# EAGLE design ArduFrauenfelderCNC_1.0_[ArduinoProMicro] (EAGLE 6.2)
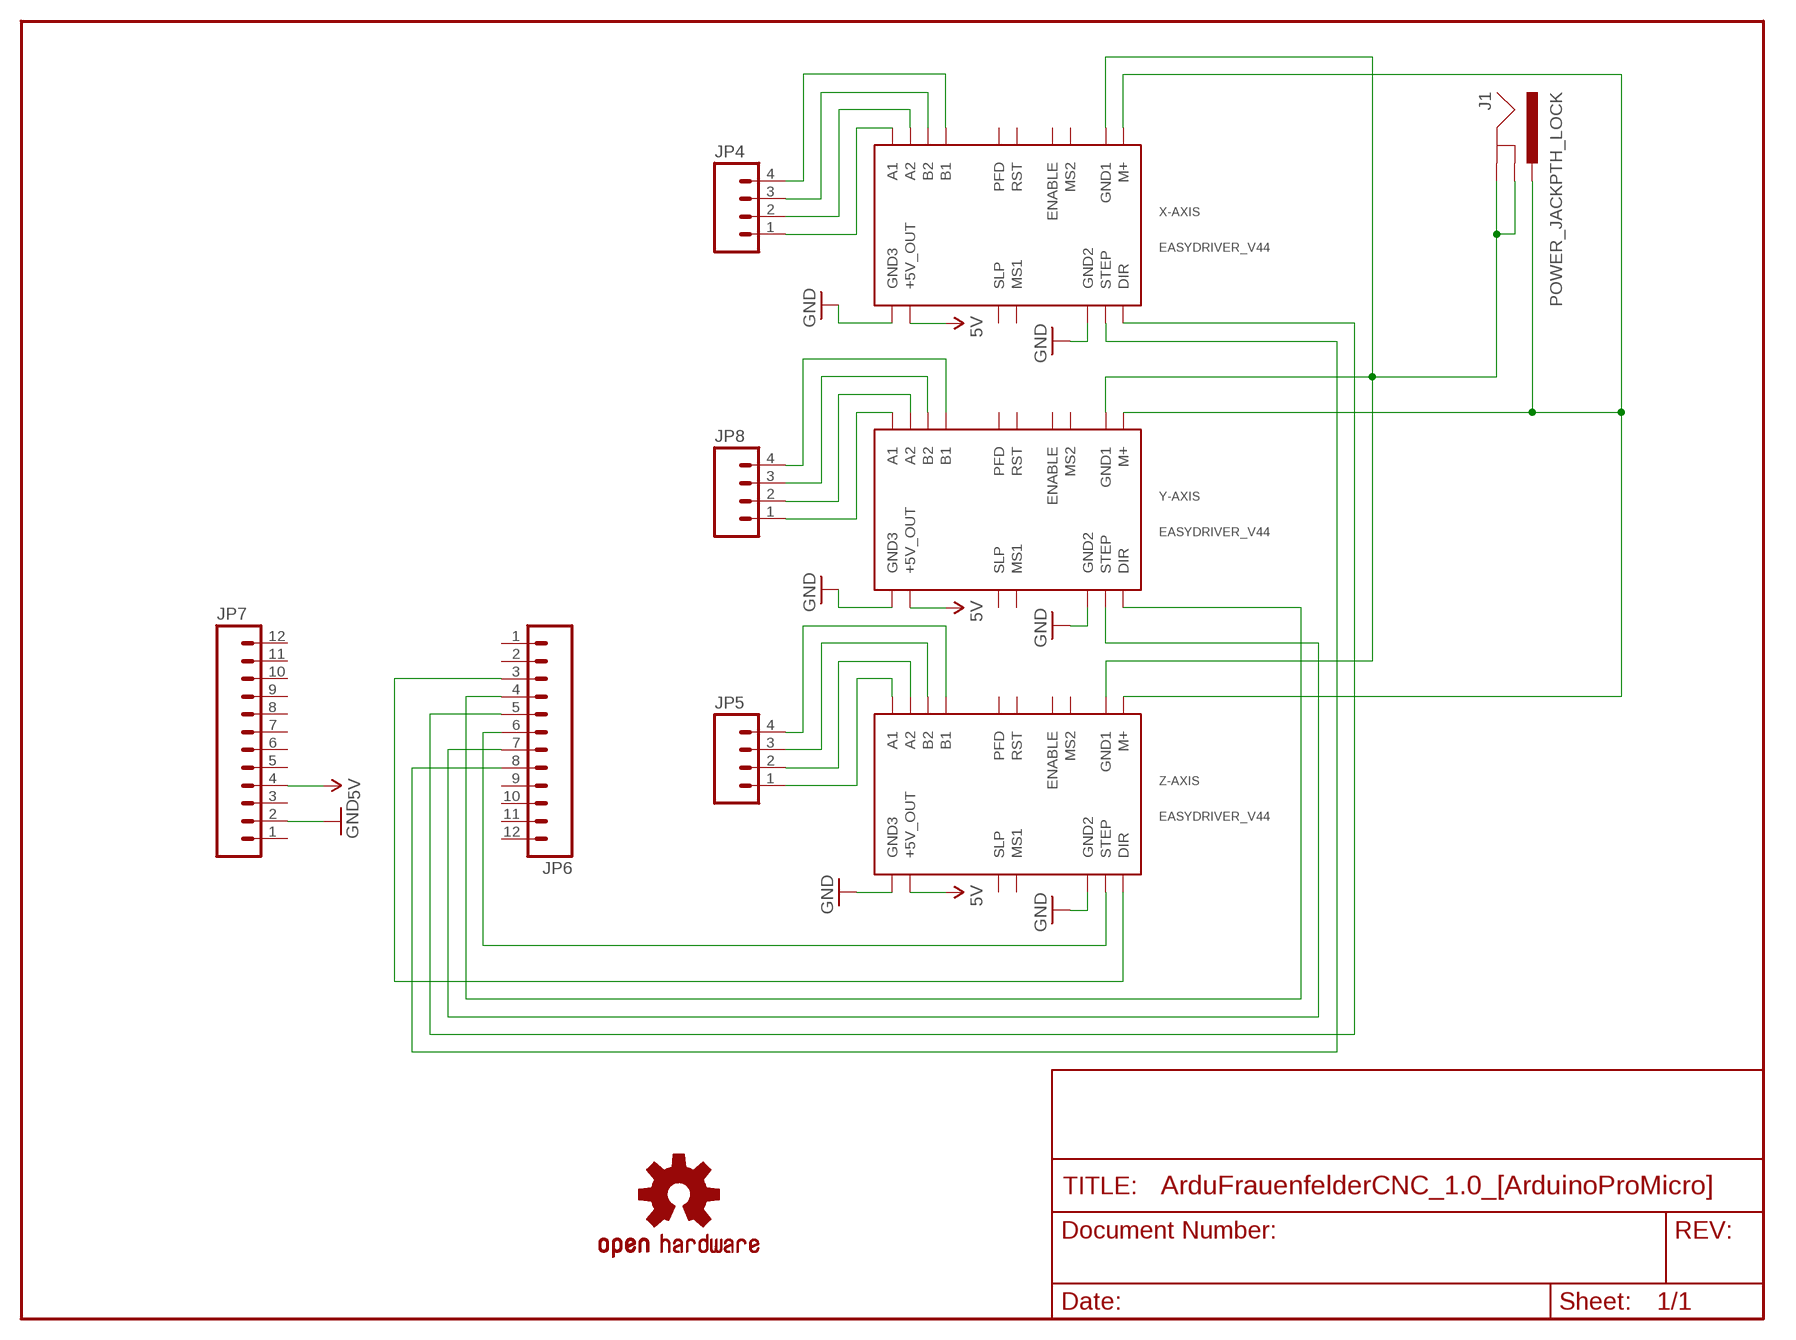
[diagram p0: schematic, sheet 1]

## Parts
J1  POWER_JACKPTH_LOCK  [POWER_JACK_PTH_LOCK]
JP4  M04LOCK_LONGPADS  [1X04_LOCK_LONGPADS]
JP5  M04LOCK_LONGPADS  [1X04_LOCK_LONGPADS]
JP6  M12PTH  [1X12]
JP7  M12PTH  [1X12]
JP8  M04LOCK_LONGPADS  [1X04_LOCK_LONGPADS]
U$2  OSHW-LOGOM  [OSHW-LOGO-M]
X-AXIS  EASYDRIVER_V44  [EASYDRIVER_V44]
Y-AXIS  EASYDRIVER_V44  [EASYDRIVER_V44]
Z-AXIS  EASYDRIVER_V44  [EASYDRIVER_V44]

## Nets
5V: JP7.4 X-AXIS.P$11(+5V_OUT) Y-AXIS.P$11(+5V_OUT) Z-AXIS.P$11(+5V_OUT)
GND: JP7.2 X-AXIS.GND2 X-AXIS.GND3 Y-AXIS.GND2 Y-AXIS.GND3 Z-AXIS.GND2 Z-AXIS.GND3
N$1: J1.GND J1.GNDBREAK X-AXIS.GND1 Y-AXIS.GND1 Z-AXIS.GND1
N$2: JP4.1 X-AXIS.A1
N$3: JP4.2 X-AXIS.A2
N$4: J1.PWR X-AXIS.M+ Y-AXIS.M+ Z-AXIS.M+
N$5: JP4.3 X-AXIS.B2
N$6: JP4.4 X-AXIS.B1
N$7: JP8.1 Y-AXIS.A1
N$8: JP8.2 Y-AXIS.A2
N$9: JP8.3 Y-AXIS.B2
N$10: JP8.4 Y-AXIS.B1
N$11: JP5.1 Z-AXIS.A1
N$12: JP5.2 Z-AXIS.A2
N$13: JP5.3 Z-AXIS.B2
N$14: JP5.4 Z-AXIS.B1
N$15: JP6.8 X-AXIS.STEP
N$16: JP6.5 X-AXIS.DIR
N$17: JP6.7 Y-AXIS.STEP
N$18: JP6.4 Y-AXIS.DIR
N$19: JP6.6 Z-AXIS.STEP
N$20: JP6.3 Z-AXIS.DIR
Unconnected: JP6.1 JP6.2 JP6.9 JP6.10 JP6.11 JP6.12 JP7.1 JP7.3 JP7.5 JP7.6 JP7.7 JP7.8 JP7.9 JP7.10 JP7.11 JP7.12 X-AXIS.ENABLE X-AXIS.MS1 X-AXIS.MS2 X-AXIS.PFD X-AXIS.RST X-AXIS.SLEEP(SLP) Y-AXIS.ENABLE Y-AXIS.MS1 Y-AXIS.MS2 Y-AXIS.PFD Y-AXIS.RST Y-AXIS.SLEEP(SLP) Z-AXIS.ENABLE Z-AXIS.MS1 Z-AXIS.MS2 Z-AXIS.PFD Z-AXIS.RST Z-AXIS.SLEEP(SLP)

## Library data of the parts
J1 = SparkFun:POWER_JACK: Power Jack This is the standard 5.5mm barrel jack for power. The PTH is the most common, proven, reliable, footprint. All others are experimental. The Slot footprint only works if the mill layer is transmitted to the PCB fab house so be warned. Spark Fun Electronics SKU : PRT-00119. Mating wall wart : TOL-00298 (and others)
JP4 JP5 JP8 = SparkFun:M04: Header 4 Standard 4-pin 0.1" header. Use with straight break away headers (SKU : PRT-00116), right angle break away headers (PRT-00553), swiss pins (PRT-00743), machine pins (PRT-00117), and female headers (PRT-00115). Molex polarized connector foot print use with SKU : PRT-08231 with associated crimp pins and housings. 1MM SMD Version SKU: PRT-10208
JP6 JP7 = SparkFun:M12: Header 12 Standard 12-pin 0.1" header. Use with straight break away headers (SKU : PRT-00116), right angle break away headers (PRT-00553), swiss pins (PRT-00743), machine pins (PRT-00117), and female headers (PRT-00115).
U$2 = SparkFun:OSHW-LOGO: Open Source Hardware Logo This logo indicates the piece of hardware it is found on incorporates a OSHW license and/or adheres to the definition of open source hardware found here: http://freedomdefined.org/OSHW
X-AXIS Y-AXIS Z-AXIS = EasyDriver:EASYDRIVER_V44: EasyDriver version 4.4 - http://www.schmalzhaus.com/EasyDriver

## Net classes
0 default: width 0.203 mm

## Board
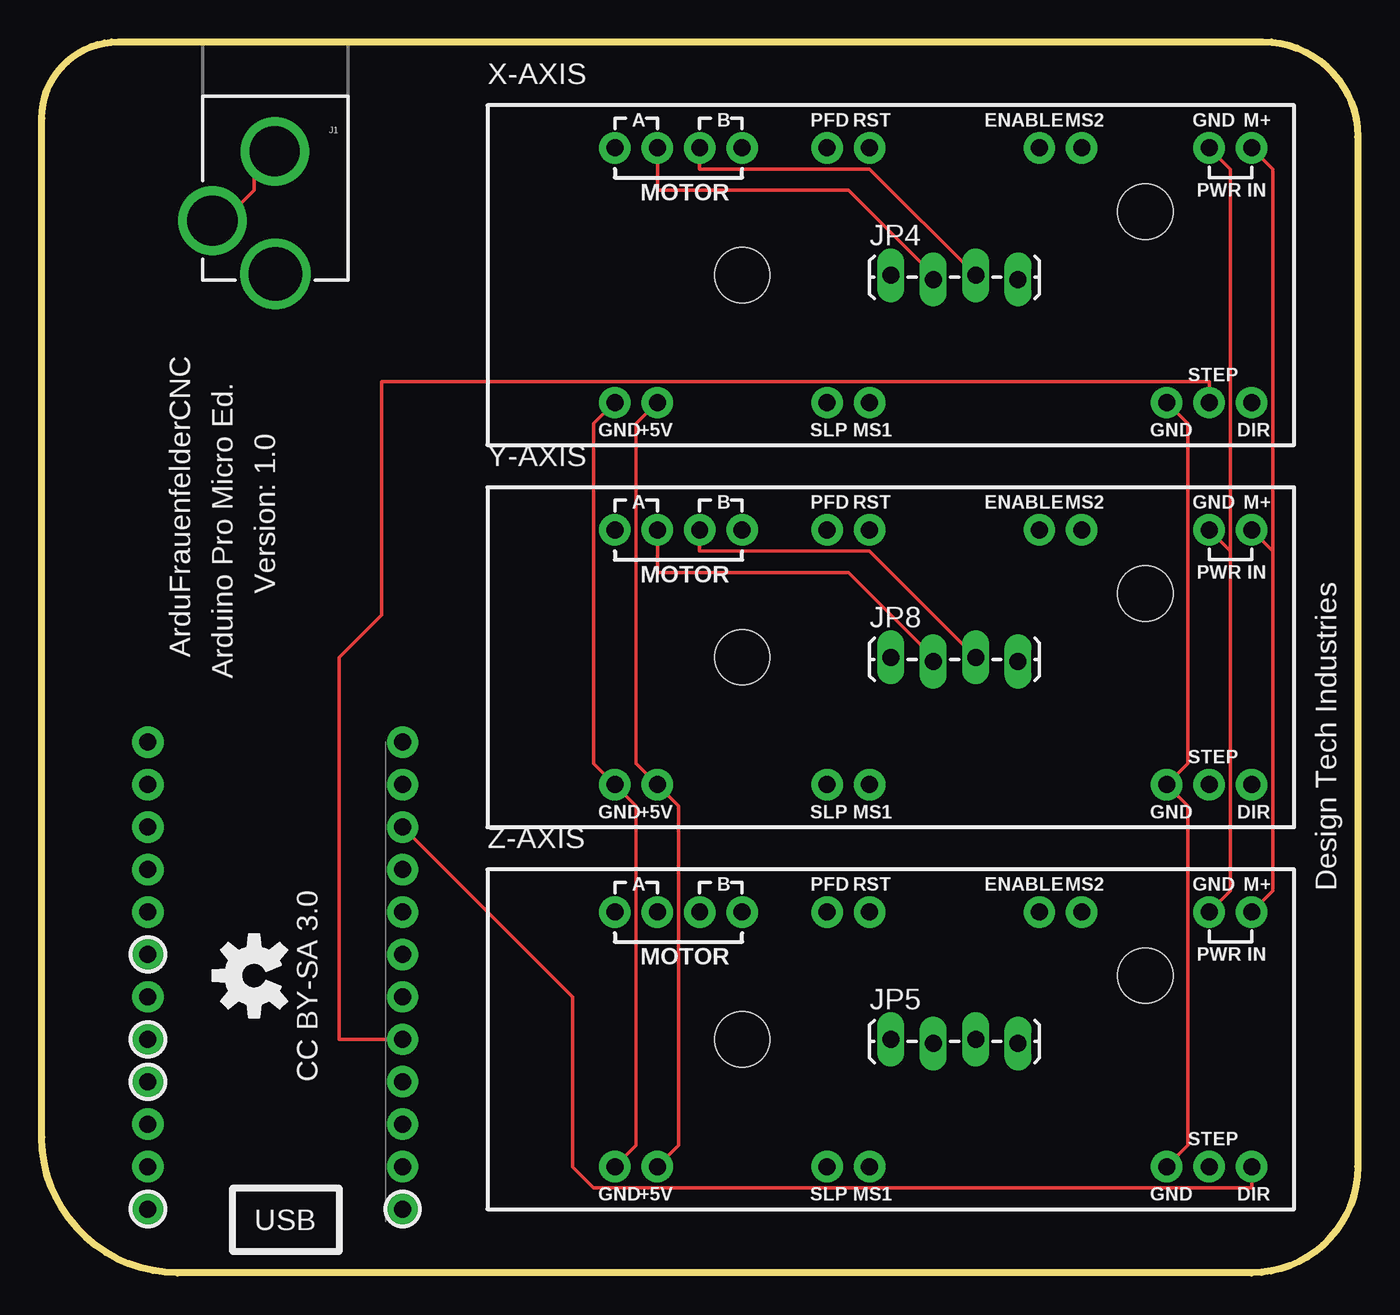
[diagram p1: board, top side]
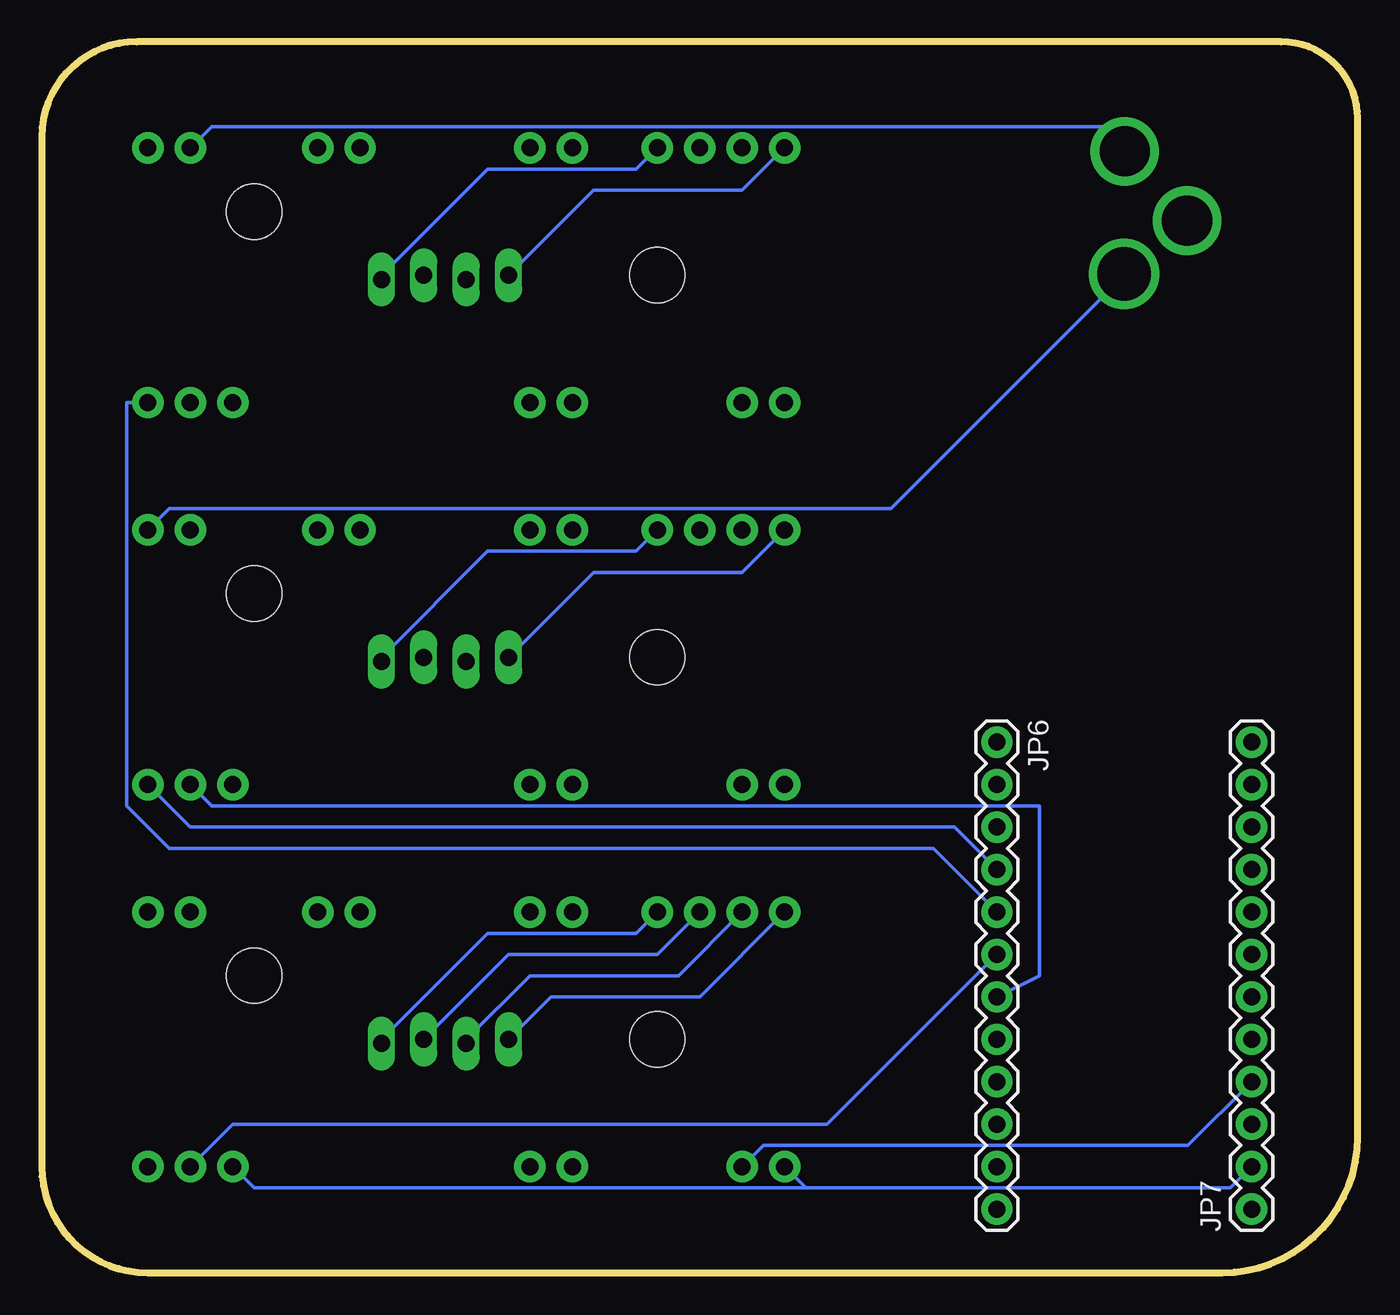
[diagram p2: board, bottom side, seen from below]

Size 78.74 x 73.66 mm. Coordinates in mm from the lower left corner, seen from the top.
Outline: 0,8.13 0,69.08 arc-90 4.58,73.66 73.06,73.66 arc-90 78.74,67.98 78.74,6.35 arc-90 72.39,0 8.13,0 arc-90 0,8.13
Copper layers (1*16): Top 0.035mm / dielectric 1.5mm / Bottom 0.035mm
Design rules: minimum track width 8mil, minimum drill 20mil, track to track 8mil, track to pad 8mil, pad to pad 8mil, via to via 8mil, smd to smd 8mil, copper to edge 10mil, drill to drill 8mil, minimum pad ring 12mil, minimum via ring 10mil, stop-mask expansion 4mil, vias tented up to drill 25mil, thermal gap 10mil

### Footprints (pad centres in the part's own frame; a part is rotated, then mirrored left to right if it is on the bottom)
POWER_JACK_PTH_LOCK = drill 2.997 pad 4.115: GND 0.025,6.557; GNDBREAK 3.762,10.7 | drill 3.2 pad 4.115: PWR 0,13.878
1X04_LOCK_LONGPADS = drill 1.016 long: 1 0,0; 2 2.54,-0.254; 3 5.08,0; 4 7.62,-0.254
1X12 = drill 1.016 pad 1.88: 1 0,0; 2 2.54,0; 3 5.08,0; 4 7.62,0; 5 10.16,0; 6 12.7,0; 7 15.24,0; 8 17.78,0; 9 20.32,0; 10 22.86,0; 11 25.4,0; 12 27.94,0
EASYDRIVER_V44 = drill 1.016 pad 1.88: A1 -16.51,7.62; A2 -13.97,7.62; B1 -8.89,7.62; B2 -11.43,7.62; DIR 21.59,-7.62; ENABLE 8.89,7.62; GND1 19.05,7.62; GND2 16.51,-7.62; GND3 -16.51,-7.62; M+ 21.59,7.62; MS1 -1.27,-7.62; MS2 11.43,7.62; P$11 -13.97,-7.62; PFD -3.81,7.62; RST -1.27,7.62; SLEEP -3.81,-7.62; STEP 19.05,-7.62 | hole 3.302: 15.24,3.81; -8.89,0

### Placement (x,y rotation side)
J1  13.97,73.66 180 top
JP4  50.8,59.69 0 top
JP5  50.8,13.97 0 top
JP6  21.59,31.75 270 bottom
JP7  6.35,3.81 90 bottom
JP8  50.8,36.83 0 top
U$2  12.7,17.78 90 top
X-AXIS  50.8,59.69 0 top
Y-AXIS  50.8,36.83 0 top
Z-AXIS  50.8,13.97 0 top

### Tracks (layer width: path | path; a pad name or v marks a point on that pad's centre or on a via)
5V
  Top 0.203: X-AXIS.P$11 35.56,50.8 35.56,30.48 Y-AXIS.P$11 38.1,27.94 38.1,7.62 Z-AXIS.P$11
  Bottom 0.203: JP7.4 10.16,7.62 35.56,7.62 Z-AXIS.P$11
GND
  Top 0.203: X-AXIS.GND2 68.58,50.8 68.58,30.48 Y-AXIS.GND2 68.58,27.94 68.58,7.62 Z-AXIS.GND2 | X-AXIS.GND3 33.02,50.8 33.02,30.48 Y-AXIS.GND3 35.56,27.94 35.56,7.62 Z-AXIS.GND3
  Bottom 0.203: JP7.2 7.62,5.08 33.02,5.08 | Z-AXIS.GND3 33.02,5.08 | Z-AXIS.GND2 66.04,5.08 33.02,5.08
N$1
  Top 0.203: Z-AXIS.GND1 71.12,22.86 71.12,43.18 | Y-AXIS.GND1 71.12,43.18 | X-AXIS.GND1 71.12,66.04 71.12,43.18 | J1.GNDBREAK 11.43,63.5 12.7,64.77 12.7,66.04 J1.GND
  Bottom 0.203: X-AXIS.GND1 68.58,68.58 15.24,68.58 13.97,67.31 J1.GND
N$2
  Bottom 0.203: JP4.1 45.72,64.77 36.83,64.77 X-AXIS.A1
N$3
  Top 0.203: X-AXIS.A2 36.83,64.77 48.26,64.77 53.34,59.69 JP4.2
N$4
  Top 0.203: Z-AXIS.M+ 73.66,22.86 73.66,43.18 | Y-AXIS.M+ 73.66,43.18 | X-AXIS.M+ 73.66,66.04 73.66,43.18
  Bottom 0.203: Y-AXIS.M+ 71.12,45.72 27.94,45.72 13.97,59.69 J1.PWR
N$5
  Top 0.203: JP4.3 49.53,66.04 39.37,66.04 X-AXIS.B2
N$6
  Bottom 0.203: X-AXIS.B1 43.18,66.04 52.07,66.04 58.42,59.69 JP4.4
N$7
  Bottom 0.203: JP8.1 45.72,41.91 36.83,41.91 Y-AXIS.A1
N$8
  Top 0.203: Y-AXIS.A2 36.83,41.91 48.26,41.91 53.34,36.83 JP8.2
N$9
  Top 0.203: JP8.3 49.53,43.18 39.37,43.18 Y-AXIS.B2
N$10
  Bottom 0.203: Y-AXIS.B1 43.18,43.18 52.07,43.18 58.42,36.83 JP8.4
N$11
  Bottom 0.203: JP5.1 48.26,16.51 39.37,16.51 Z-AXIS.A1
N$12
  Bottom 0.203: Z-AXIS.A2 40.64,17.78 49.53,17.78 53.34,13.97 JP5.2
N$13
  Bottom 0.203: JP5.3 50.8,19.05 41.91,19.05 Z-AXIS.B2
N$14
  Bottom 0.203: Z-AXIS.B1 43.18,20.32 52.07,20.32 58.42,13.97 JP5.4
N$15
  Top 0.203: JP6.8 17.78,13.97 17.78,36.83 20.32,39.37 20.32,53.34 69.85,53.34 X-AXIS.STEP
N$16
  Bottom 0.203: JP6.5 25.4,25.4 71.12,25.4 73.66,27.94 73.66,52.07 X-AXIS.DIR
N$17
  Bottom 0.203: JP6.7 19.05,17.78 19.05,27.94 68.58,27.94 Y-AXIS.STEP
N$18
  Bottom 0.203: JP6.4 24.13,26.67 69.85,26.67 Y-AXIS.DIR
N$19
  Bottom 0.203: JP6.6 31.75,8.89 67.31,8.89 Z-AXIS.STEP
N$20
  Top 0.203: JP6.3 31.75,16.51 31.75,6.35 33.02,5.08 72.39,5.08 Z-AXIS.DIR

### Text on the board
tPlace: Version: 1.0 | ArduFrauenfelderCNC | Arduino Pro Micro Ed. | Design Tech Industries | CC BY-SA 3.0 | USB
tValues: Valid combinations: | 3.3V Reg / 8MHz | 5V Reg / 16MHz | Mark back accordingly